# Altium schematic sheet thermistorADC.SchDoc
size A4; DocumentNumber: 11; SheetNumber: 11; SheetTotal: 11
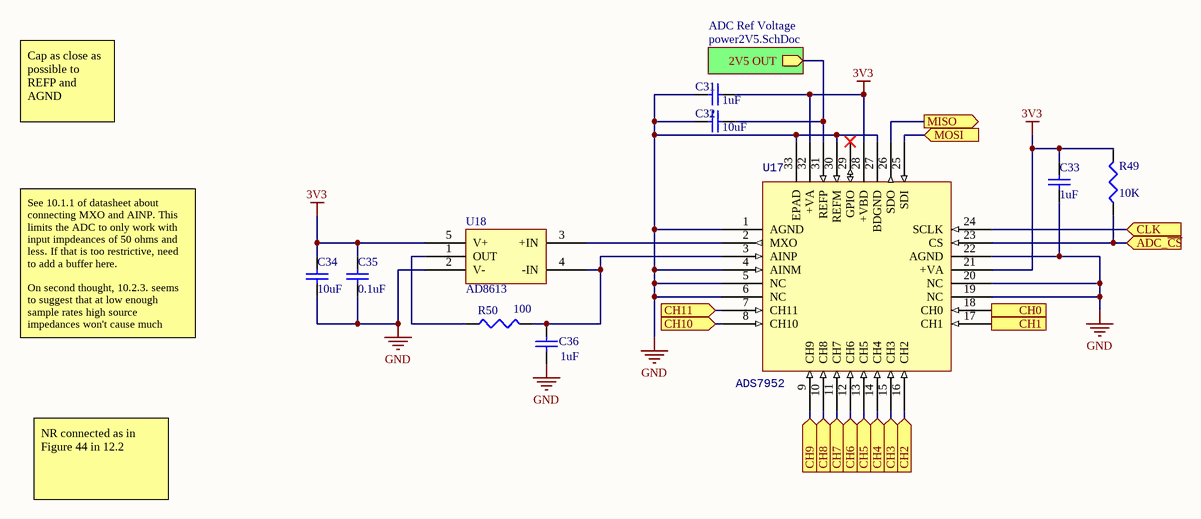
[diagram p0: thermistorADC.SchDoc]

## Parts
C31  1uF  [1608[0603]]
C32  10uF  [1608[0603]]
C33  1uF  [1608[0603]]
C34  10uF  [1608[0603]]
C35  0.1uF  [1608[0603]]
C36  1uF  [1608[0603]]
R49  10K  [J1-0603]
R50  100  [J1-0603]
U17  ADS7952
U18  AD8613  [SOP-65P200X125-5N]

## Sub-sheets
ADC Ref Voltage = power2V5.SchDoc: 2V5 OUT (out)

## Ports
ADC_~{CS} (in), CH0 (in), CH1 (in), CH2 (in), CH3 (in), CH4 (in), CH5 (in), CH6 (in), CH7 (in), CH8 (in), CH9 (in), CH10 (in), CH11 (in), CLK (in), MISO (out), MOSI (in)

## Nets
3V3: C31.2 C33.2 C34.2 C35.2 R49.2 U17.21(+VA) U17.28(+VBD) U17.32(+VA) U18.5(V+)
GND: C31.1 C32.1 C33.1 C34.1 C35.1 C36.1 U17.1(AGND) U17.4(AINM) U17.5(NC) U17.6(NC) U17.19(NC) U17.20(NC) U17.22(AGND) U17.27(BDGND) U17.30(REFM) U17.33(EPAD) U18.2(V-)
ADC_~{CS}: R49.1 U17.23(CS) ; port ADC_~{CS}
CH0: U17.18(CH0) ; port CH0
CH1: U17.17(CH1) ; port CH1
CH2: U17.16(CH2) ; port CH2
CH3: U17.15(CH3) ; port CH3
CH4: U17.14(CH4) ; port CH4
CH5: U17.13(CH5) ; port CH5
CH6: U17.12(CH6) ; port CH6
CH7: U17.11(CH7) ; port CH7
CH8: U17.10(CH8) ; port CH8
CH9: U17.9(CH9) ; port CH9
CH10: U17.8(CH10) ; port CH10
CH11: U17.7(CH11) ; port CH11
CLK: U17.24(SCLK) ; port CLK
MISO: U17.26(SDO) ; port MISO
MOSI: U17.25(SDI) ; port MOSI
NetC32_2: C32.2 U17.31(REFP) ; sheet ADC Ref Voltage/2V5 OUT
NetC36_2: C36.2 R50.2 U17.3(AINP) U18.4(-IN)
NetR50_1: R50.1 U18.1(OUT)
NetU17_2: U17.2(MXO) U18.3(+IN)

Not connected (* = marked no-connect by the designer): U17 29(GPIO)*

## Notes on the sheet
- Cap as close as possible to REFP and AGND
- See 10.1.1 of datasheet about connecting MXO and AINP. This limits the ADC to only work with input impdeances of 50 ohms and less. If that is too restrictive, need to add a buffer here.
  On second thought, 10.2.3. seems to suggest that at low enough sample rates high source impedances won't cause much issue.
- NR connected as in Figure 44 in 12.2

## Library data of the parts
C31 C33-C36 = Cap Semi: Capacitor (Semiconductor SIM Model); Published: 8-Jun-2000; LatestRevisionDate: 29-May-2009; LatestRevisionNote: IPC-7351 Footprint Added.; PackageReference: C1206; Publisher: Altium Limited; PackageDescription: Chip Capacitor; Supplier: Digi-Key; Supplier 1: Digi-Key
  C31 C33 C36: Value: 1uF; Supplier Part Number: 1276-1860-1-ND
  C34: Value: 10uF; Supplier Part Number: 490-10475-1-ND
  C35: Value: 0.1uF; Supplier Part Number: 311-1341-1-ND
C32 = Cap: Capacitor; Published: 8-Jun-2000; LatestRevisionDate: 17-Jul-2002; LatestRevisionNote: Re-released for DXP Platform.; PackageReference: *; Publisher: Altium Limited; PackageDescription: Chip Capacitor; Value: 10uF; Supplier: Digi-Key; Supplier Part Number: 490-10475-1-ND; Supplier 1: Digi-Key
R49 R50 = Res3: Resistor; Published: 8-Jun-2000; LatestRevisionDate: 29-May-2009; LatestRevisionNote: IPC-7351 Footprint Added.; PackageReference: J1-0603; Publisher: Altium Limited; PackageDescription: Chip Resistor; Supplier: Digi-Key; Supplier 1: Digi-Key; Supplier Part Number: RMCF0603JG10K0CT-ND
  R49: Value: 10K
  R50: Value: 100
U17 = ADS7952: ADC; Supplier 1: Digi-Key; Supplier Part Number 1: 296-25842-1-ND; Supplier: Digi-Key; Supplier Part Number: 296-25842-1-ND
U18 = AD8613: Low power, low noise rail-to-rail op-amp.; Supplier: Digi-Key; Supplier 1: Digi-Key; Supplier Part Number: AD8613AKSZ-REEL7CT-ND